# EAGLE schematic Tracksoar shield (EAGLE 7.3.0)
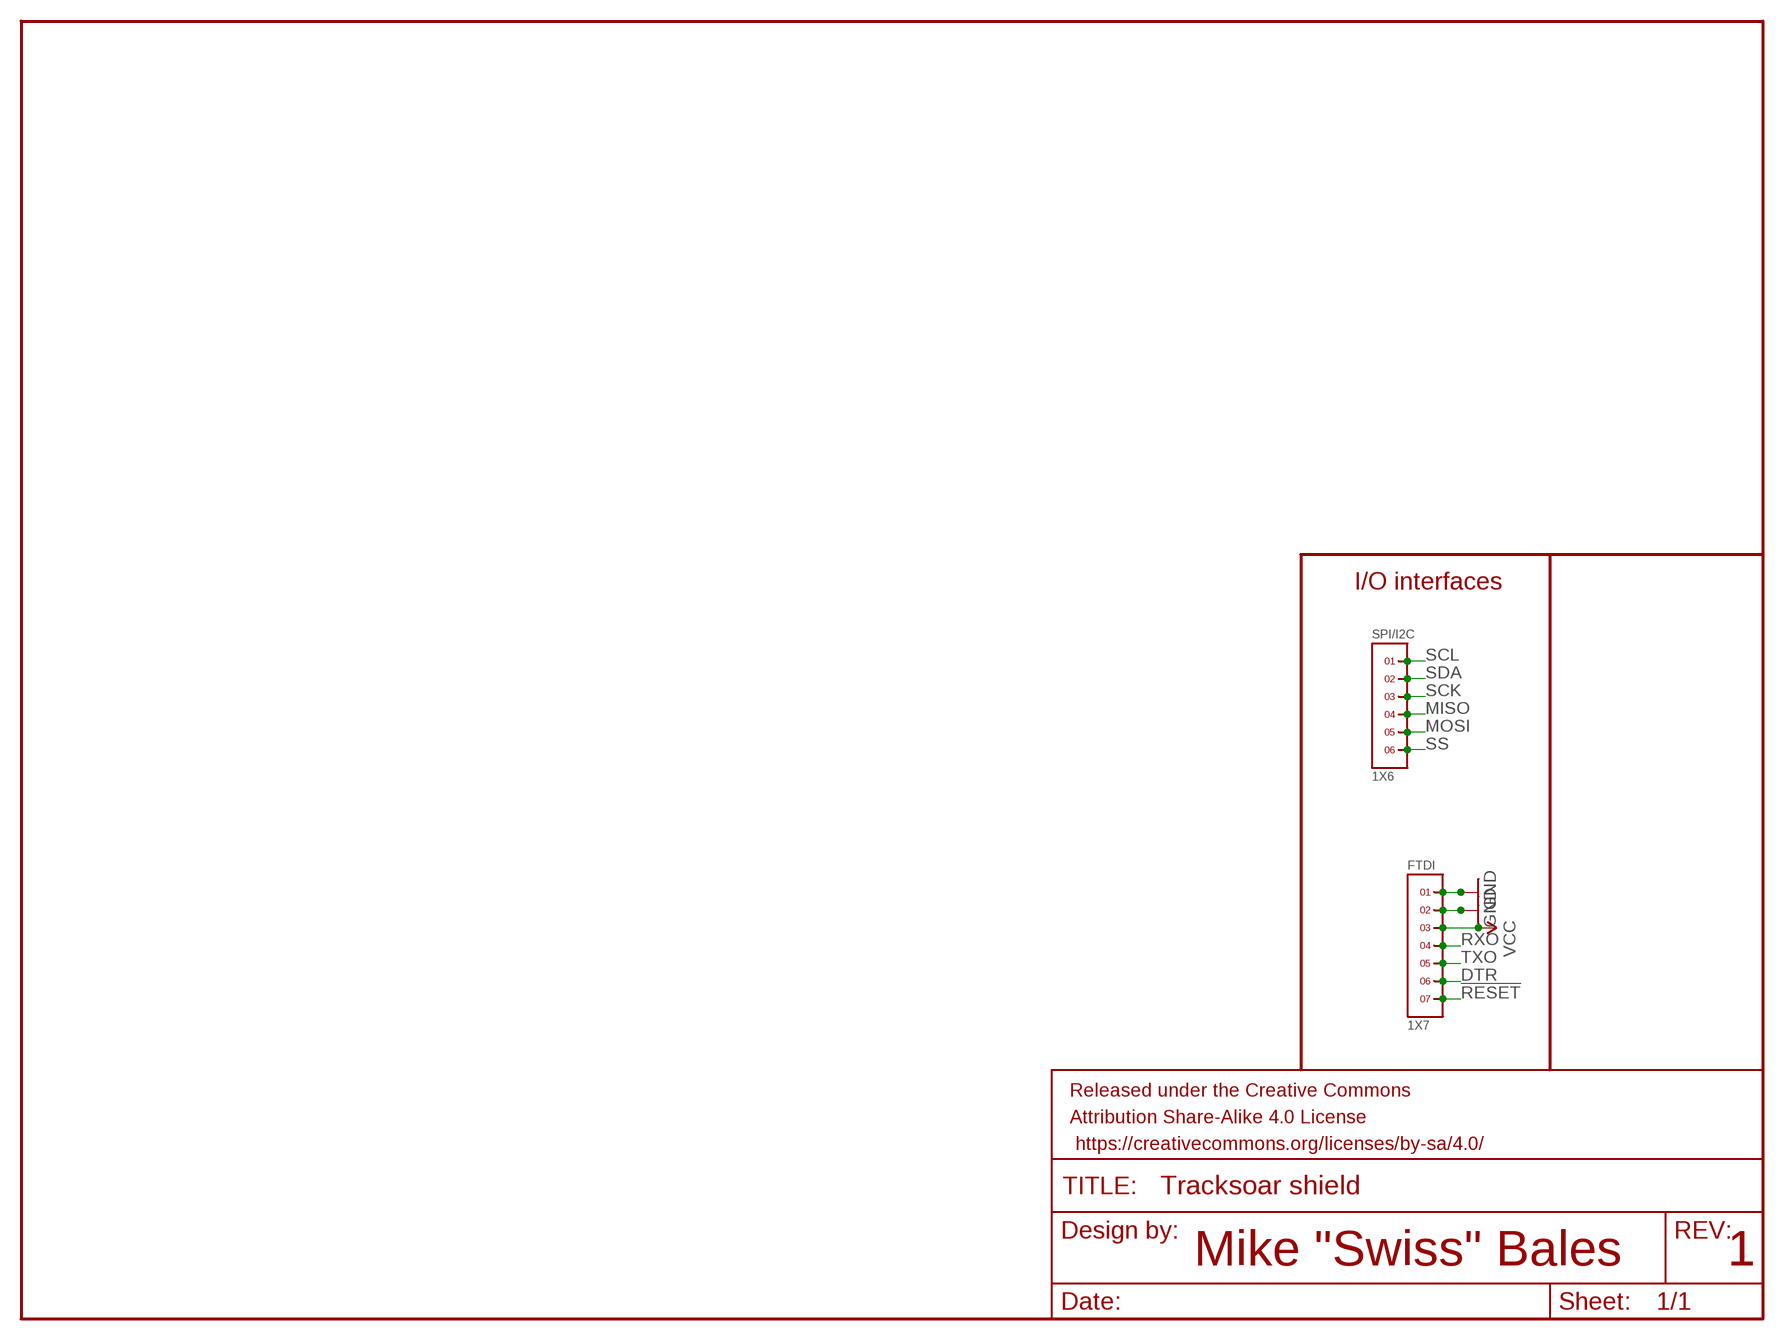
[diagram p0: schematic, sheet 1]

## Parts
FRAME1  FRAME-LETTER  [CREATIVE_COMMONS]
FTDI  1X7  [1X7]
SPI/I2C  1X6  [1X6]

## Nets
!RESET: FTDI.7
DTR: FTDI.6
GND: FTDI.1 FTDI.2
MISO: SPI/I2C.4
MOSI: SPI/I2C.5
RXO: FTDI.4
SCK: SPI/I2C.3
SCL: SPI/I2C.1
SDA: SPI/I2C.2
SS: SPI/I2C.6
TXO: FTDI.5
VCC: FTDI.3

## Notes on the sheet
- I/O interfaces
- Mike "Swiss" Bales | 1

## Library data of the parts
FRAME1 = SparkFun-Aesthetics:FRAME-LETTER: Schematic Frame Standard 8.5x11 US Letter frame
FTDI = headers(2mm):1X7
SPI/I2C = headers(2mm):1X6